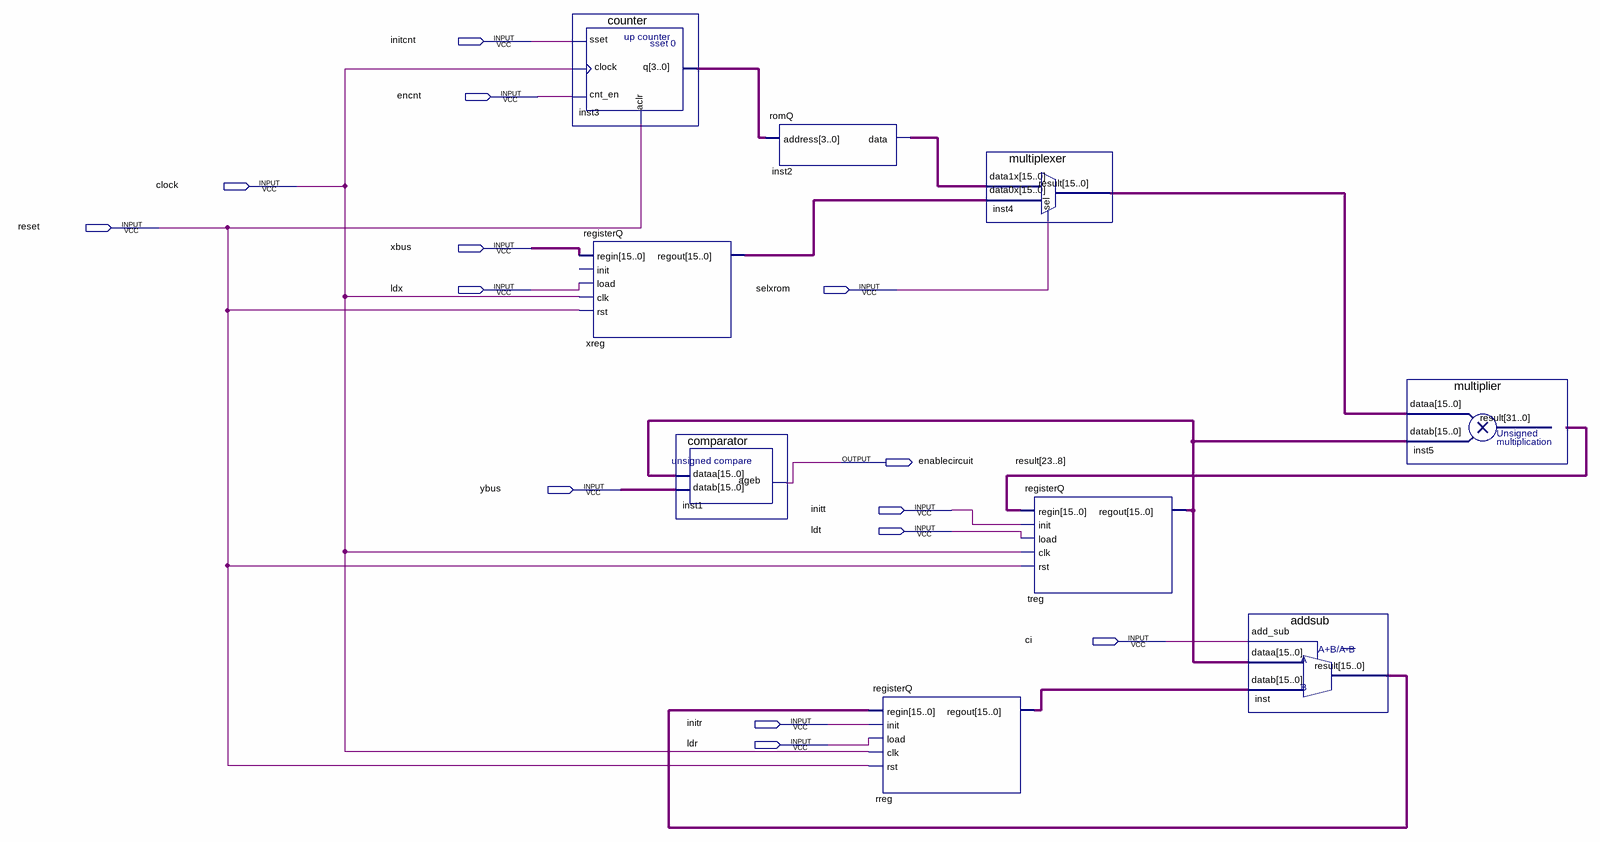
[diagram p0: schematic sheet]
// Quartus schematic datapathQblock.bdf as structural Verilog: 9 symbols, 14 pins
module datapathQblock (
  input  initcnt,
  input  encnt,
  input  clock,
  input  reset,
  input  xbus,
  input  ldx,
  input  selxrom,
  input  ybus,
  input  initt,
  input  ldt,
  input  ci,
  input  initr,
  input  ldr,
  output enablecircuit
);

  wire [3:0] inst3_q;
  wire [15:0] inst2_data, inst4_result, inst_result, rreg_regout, treg_regout, undriven, undriven_2,
       xreg_regout;
  wire [23:8] result;

  counter inst3 (.sset(initcnt), .clock(clock), .cnt_en(encnt), .aclr(reset), .q(inst3_q));
  registerQ xreg (.regin(undriven), .load(ldx), .clk(clock), .rst(reset), .regout(xreg_regout));  // open: init
  comparator inst1 (.dataa(treg_regout), .datab(undriven_2), .ageb(enablecircuit));
  romQ inst2 (.address(inst3_q), .data(inst2_data));
  registerQ rreg (.regin(inst_result), .init(initr), .load(ldr), .clk(clock), .rst(reset), .regout(rreg_regout));
  multiplexer inst4 (.data1x(inst2_data), .data0x(xreg_regout), .sel(selxrom), .result(inst4_result));
  registerQ treg (.regin(result), .init(initt), .load(ldt), .clk(clock), .rst(reset), .regout(treg_regout));
  addsub inst (.add_sub(ci), .dataa(treg_regout), .datab(rreg_regout), .result(inst_result));
  multiplier inst5 (.dataa(inst4_result), .datab(treg_regout), .result(result));
endmodule
